# EAGLE design Raspi-TPUART (EAGLE 9.6.2)
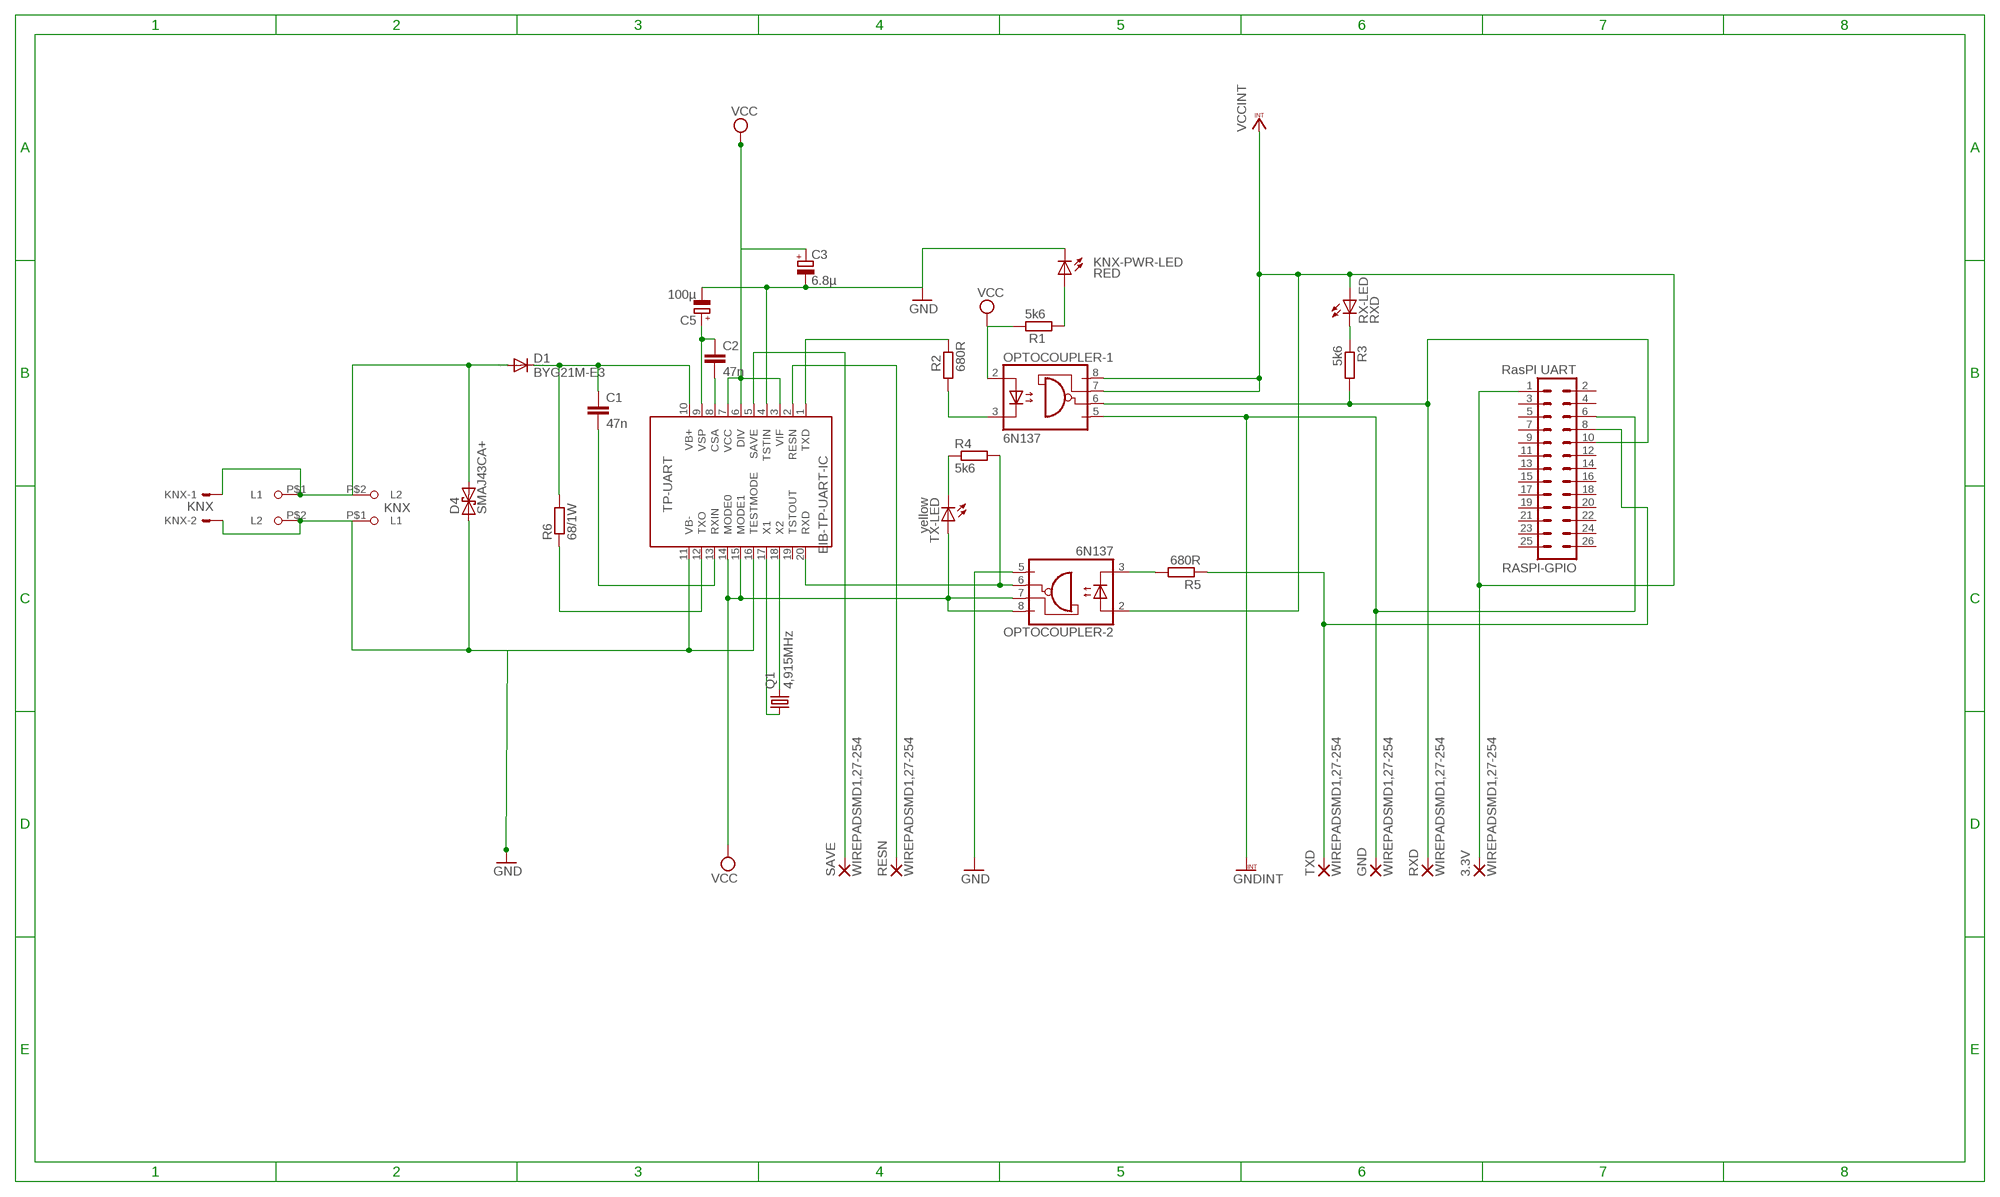
[diagram p0: schematic, sheet 1]

## Parts
3.3V  WIREPADSMD1,27-254  [SMD1,27-2,54]
C1  47n  C-EUC1206  [C1206]
C2  47n  C-EUC1206  [C1206]
C3  6.8µ  CPOL-EUD/7343-31R  [D/7343-31R]
C5  100µ  CPOL-EUD/7343-31R  [D/7343-31R]
D1  BYG21M-E3  ES2D  [SMB]
D4  SMAJ43CA+  BZW04XXB  [DO214AA]
EIB-TP-UART-IC  TP-UART  [SOIC20]
GND  WIREPADSMD1,27-254  [SMD1,27-2,54]
KNX  KNX  22-23-2021  [22-23-2021]
KNX-PWR-LED  RED  LEDKA-3528ASYC  [KA-3528ASYC]
KNX_WAGO_243  243-211  [243-211]
OPTOCOUPLER-1  6N137  [DIL8-SMD]
OPTOCOUPLER-2  6N137  [DIL8-SMD]
Q1  4,915MHz  CRYSTALHC49UP  [HC49UP]
R1  5k6  R-EU_M1206  [M1206]
R2  680R  R-EU_M1206  [M1206]
R3  5k6  R-EU_M1206  [M1206]
R4  5k6  R-EU_M1206  [M1206]
R5  680R  R-EU_M1206  [M1206]
R6  68/1W  R-EU_R2512  [R2512]
RASPI-GPIO  RasPI UART  MA13-2  [MA13-2]
RESN  WIREPADSMD1,27-254  [SMD1,27-2,54]
RX-LED  RXD  LEDKA-3528ASYC  [KA-3528ASYC]
RXD  WIREPADSMD1,27-254  [SMD1,27-2,54]
SAVE  WIREPADSMD1,27-254  [SMD1,27-2,54]
TX-LED  yellow  LEDKA-3528ASYC  [KA-3528ASYC]
TXD  WIREPADSMD1,27-254  [SMD1,27-2,54]
U$1  243-211  [243-211]

## Nets
CSA: C2.2 EIB-TP-UART-IC.8(CSA)
GND [supply]: C3.- C5.- D4.A EIB-TP-UART-IC.4(TSTIN) EIB-TP-UART-IC.11(VB-) EIB-TP-UART-IC.16(TESTMODE) KNX-PWR-LED.C KNX.2 KNX_WAGO_243.P$1(L1) OPTOCOUPLER-2.5(GND) U$1.P$2(L2)
GNDINT [supply]: GND.1(P) OPTOCOUPLER-1.5(GND) RASPI-GPIO.6
KNX+ [supply]: D1.A D4.C KNX.1 KNX_WAGO_243.P$2(L2) U$1.P$1(L1)
N$1: R3.1 RX-LED.C
N$3: R4.1 TX-LED.C
N$14: OPTOCOUPLER-2.3(C) R5.2
N$18: KNX-PWR-LED.A R1.1
RASPI_RXD: OPTOCOUPLER-1.6(VO) R3.2 RASPI-GPIO.10 RXD.1(P)
RASPI_TXD: R5.1 RASPI-GPIO.8 TXD.1(P)
RESN: EIB-TP-UART-IC.2(RESN) RESN.1(P)
RXD: EIB-TP-UART-IC.20(RXD) OPTOCOUPLER-2.6(VO) R4.2
RXIN: C1.2 EIB-TP-UART-IC.13(RXIN)
SAVE: EIB-TP-UART-IC.5(SAVE) SAVE.1(P)
TXD: EIB-TP-UART-IC.1(TXD) R2.2
TXD1: OPTOCOUPLER-1.3(C) R2.1
TXO: EIB-TP-UART-IC.12(TXO) R6.1
VB+ [supply]: C1.1 D1.C EIB-TP-UART-IC.10(VB+) R6.2
VCC [supply]: C3.+ EIB-TP-UART-IC.3(VIF) EIB-TP-UART-IC.6(DIV) EIB-TP-UART-IC.7(VCC) EIB-TP-UART-IC.14(MODE0) EIB-TP-UART-IC.15(MODE1) OPTOCOUPLER-1.2(A) OPTOCOUPLER-2.7(VE) OPTOCOUPLER-2.8(VCC) R1.2 TX-LED.A
VCCINT [supply]: 3.3V.1(P) OPTOCOUPLER-1.7(VE) OPTOCOUPLER-1.8(VCC) OPTOCOUPLER-2.2(A) RASPI-GPIO.1 RX-LED.A
VSP: C2.1 C5.+ EIB-TP-UART-IC.9(VSP)
X1: EIB-TP-UART-IC.17(X1) Q1.1
X2: EIB-TP-UART-IC.18(X2) Q1.2
Unconnected: EIB-TP-UART-IC.19(TSTOUT) RASPI-GPIO.2 RASPI-GPIO.3 RASPI-GPIO.4 RASPI-GPIO.5 RASPI-GPIO.7 RASPI-GPIO.9 RASPI-GPIO.11 RASPI-GPIO.12 RASPI-GPIO.13 RASPI-GPIO.14 RASPI-GPIO.15 RASPI-GPIO.16 RASPI-GPIO.17 RASPI-GPIO.18 RASPI-GPIO.19 RASPI-GPIO.20 RASPI-GPIO.21 RASPI-GPIO.22 RASPI-GPIO.23 RASPI-GPIO.24 RASPI-GPIO.25 RASPI-GPIO.26

## Library data of the parts
3.3V GND RESN RXD SAVE TXD = wirepad:WIREPAD: Wire PAD connect wire on PCB
C1 C2 = resistor:C-EU: CAPACITOR, European symbol
C3 C5 = resistor:CPOL-EU: POLARIZED CAPACITOR, European symbol
D1 = diode:ES2D: DIODE super fast rectifier, 2 A
D4 = diode:BZW04XXB: DIODE uni and bidirectional supressor diode
EIB-TP-UART-IC = tpuart-actiface:TP-UART: Siemens TP-UART
KNX = con-molex:22-23-2021: .100" (2.54mm) Center Header - 2 Pin; MF: MOLEX; MPN: 22-23-2021; OC_FARNELL: 1462926; OC_NEWARK: 25C3832
KNX-PWR-LED RX-LED TX-LED = led:LED: LED OSRAM: - CHIPLED LG R971, LG N971, LY N971, LG Q971, LY Q971, LO R971, LY R971 LH N974, LH R974 LS Q976, LO Q976, LY Q976 LO Q996 - Hyper CHIPLED LW Q18S LB Q993, LB Q99A, LB R99A - SideLED LS A670, LO A670, LY A670, LG A670, LP A670 LB A673, LV A673, LT A673, LW A673 LH A674 LY A675 LS A676, LA A676, LO A676, LY A676, LW A676 LS A679, LY A679, LG A679 - Hyper Micro SIDELED® LS Y876, LA Y876, LO Y876, LY Y876 LT Y87S - SmartLED LW L88C, LW L88S LB L89C, LB L89S, LG L890 LS L89K, LO L89K, LY L89K LS L896, LA L896, LO L896, LY L896 - TOPLED LS T670, LO T670, LY T670, LG T670, LP T670 LSG T670, LSP T670, LSY T670, LOP T670, LYG T670 LG T671, LOG T671, LSG T671 LB T673, LV T673, LT T673, LW T673 LH T674 LS T676, LA T676, LO T676, LY T676, LB T676, LH T676, LSB T676, LW T676 LB T67C, LV T67C, LT T67C, LS T67K, LO T67K, LY T67K, LW E67C LS E67B, LA E67B, LO E67B, LY E67B, LB E67C, LV E67C, LT E67C LW T67C LS T679, LY T679, LG T679 LS T770, LO T770, LY T770, LG T770, LP T770 LB T773, LV T773, LT T773, LW T773 LH T774 LS E675, LA E675, LY E675, LS T675 LS T776, LA T776, LO T776, LY T776, LB T776 LHGB T686 LT T68C, LB T68C - Hyper Mini TOPLED® LB M676 - Mini TOPLED Santana® LG M470 LS M47K, LO M47K, LY M47K Source: http://www.osram.convergy.de LUXEON: - LUMILED® LXK2-PW12-R00, LXK2-PW12-S00, LXK2-PW14-U00, LXK2-PW14-V00 LXK2-PM12-R00, LXK2-PM12-S00, LXK2-PM14-U00 LXK2-PE12-Q00, LXK2-PE12-R00, LXK2-PE12-S00, LXK2-PE14-T00, LXK2-PE14-U00 LXK2-PB12-K00, LXK2-PB12-L00, LXK2-PB12-M00, LXK2-PB14-N00, LXK2-PB14-P00, LXK2-PB14-Q00 LXK2-PR12-L00, LXK2-PR12-M00, LXK2-PR14-Q00, LXK2-PR14-R00 LXK2-PD12-Q00, LXK2-PD12-R00, LXK2-PD12-S00 LXK2-PH12-R00, LXK2-PH12-S00 LXK2-PL12-P00, LXK2-PL12-Q00, LXK2-PL12-R00 Source: www.luxeon.com KINGBRIGHT: KA-3528ASYC Source: www.kingbright.com
KNX_WAGO_243 U$1 = wago-243:243-211: WAGO 243-211 KNX-Connector
OPTOCOUPLER-1 OPTOCOUPLER-2 = optocoupler:6N137: MOTOROLA OPTO COUPLER
Q1 = crystal:CRYSTAL: CRYSTAL; OC_FARNELL: unknown; OC_NEWARK: unknown
R1-R6 = resistor:R-EU_: RESISTOR, European symbol
RASPI-GPIO = con-lstb:MA13-2: PIN HEADER; OC_FARNELL: unknown; OC_NEWARK: unknown

## Net classes
0 default: width 0.3 mm
1 supply: width 0.6 mm

## Board
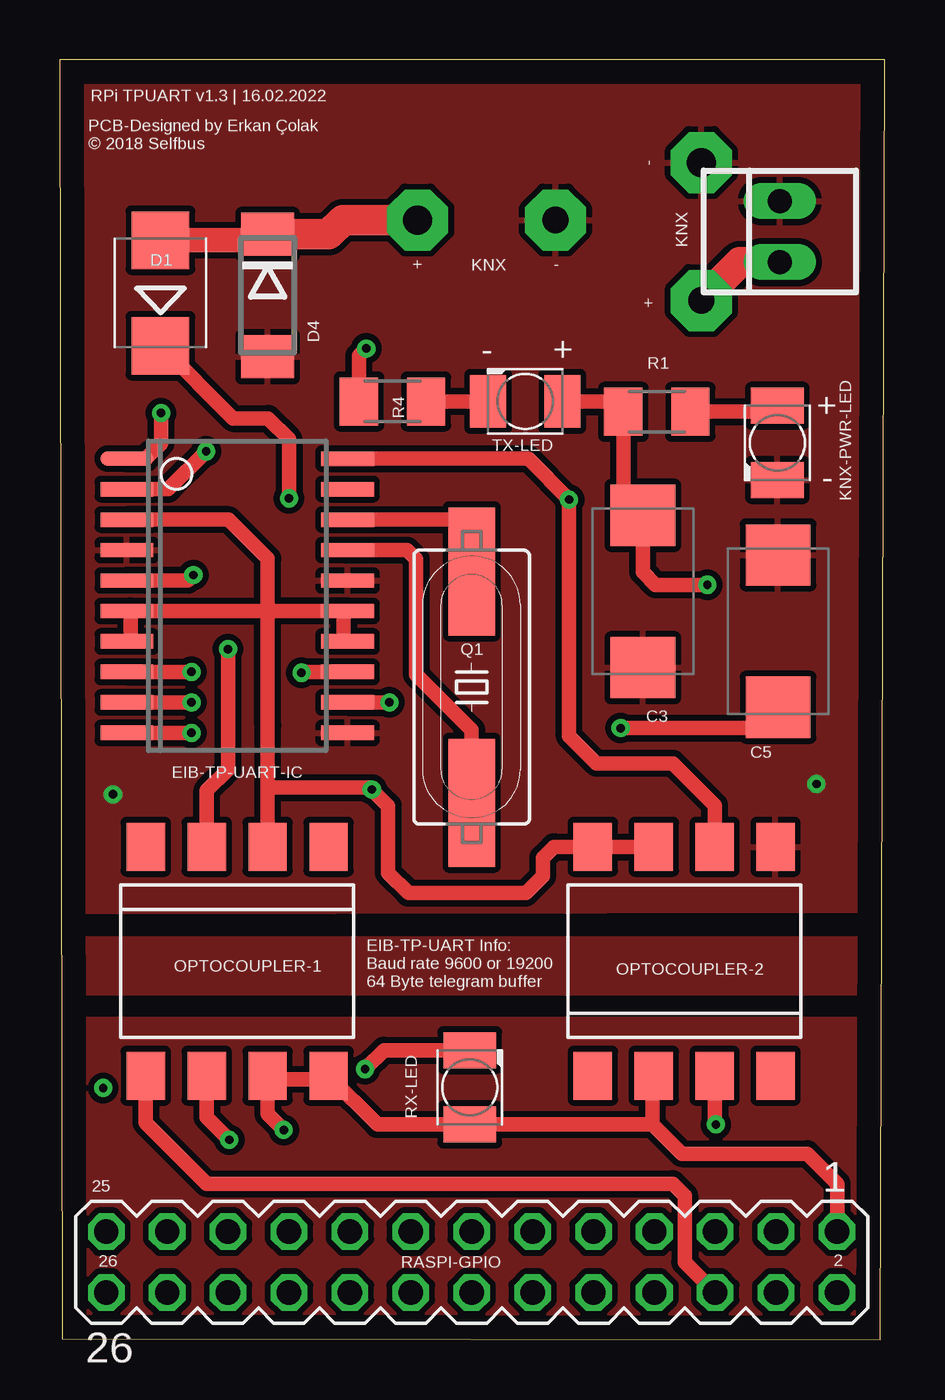
[diagram p1: board, top side]
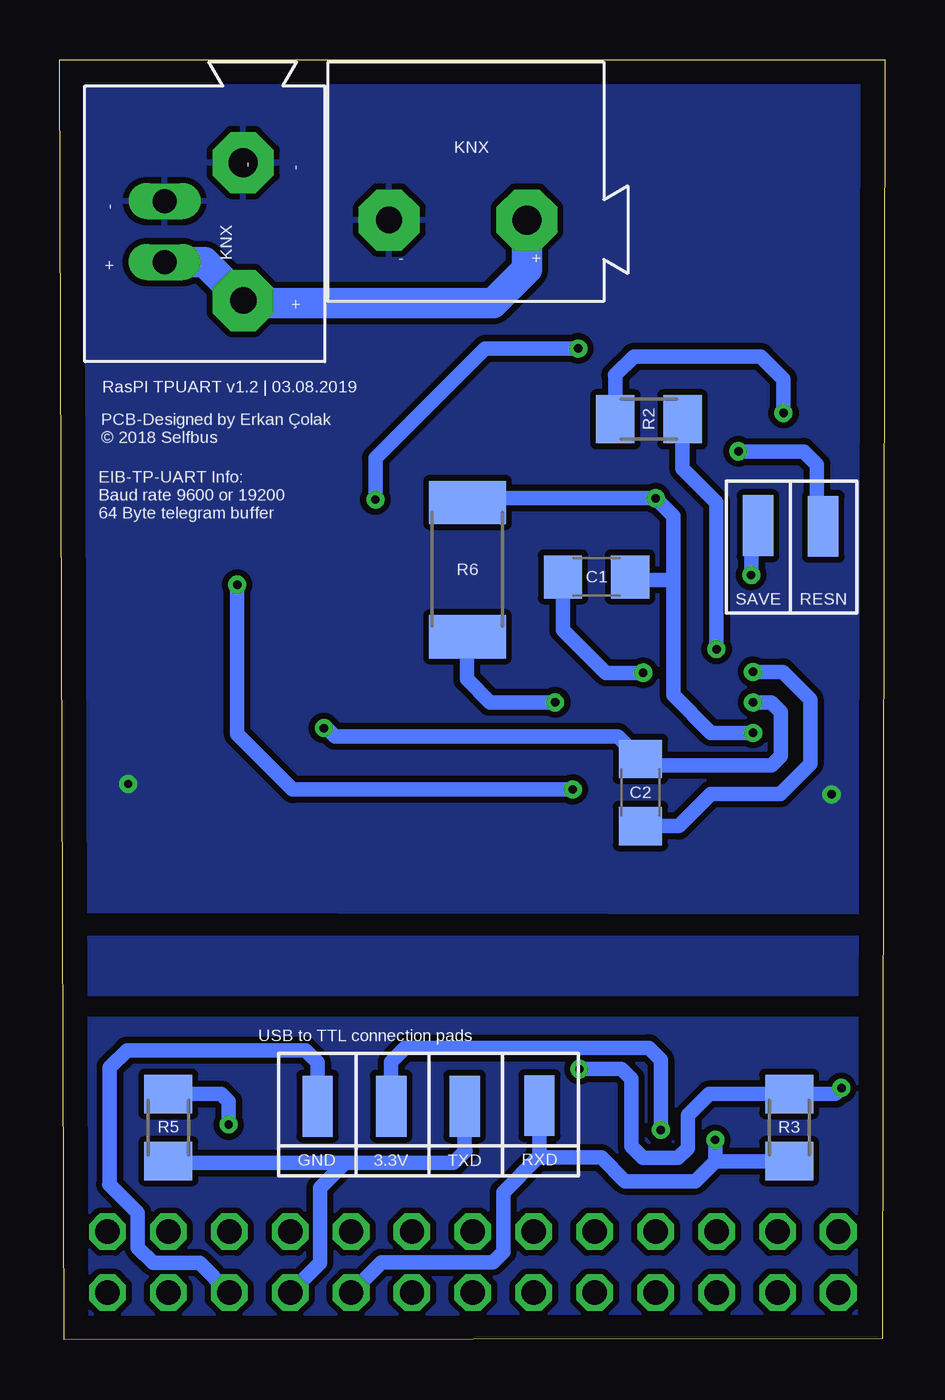
[diagram p2: board, bottom side, seen from below]

Size 34.39 x 53.36 mm. Coordinates in mm from the lower left corner, seen from the top.
Outline: 0.1,0.03 34.21,0 34.39,53.36 0,53.36 0.1,0.03
Copper layers (1*16): Top 0.035mm / dielectric 1.5mm / Bottom 0.035mm
Design rules "default": minimum track width 6mil, minimum drill 0.35mm, track to track 6mil, track to pad 6mil, pad to pad 6mil, via to via 6mil, smd to smd 6mil, copper to edge 40mil, drill to drill 6mil, minimum pad ring 10mil, minimum via ring 8mil, stop-mask expansion 4mil, vias tented up to drill 0mil, thermal gap 10mil

### Footprints (pad centres in the part's own frame; a part is rotated, then mirrored left to right if it is on the bottom)
SMD1,27-2,54 = smd 1.27 x 2.54: 1 0,0
C1206 = smd 1.6 x 1.8: 1 -1.4,0; 2 1.4,0
D/7343-31R = smd 2.55 x 2.7: + 3.175,0; - -3.175,0
SMB = smd 2.4 x 2.4: A 2.2,0; C -2.2,0
DO214AA = smd 1.8 x 2.2: A 2.55,0; C -2.55,0
SOIC20 = smd 0.6 x 2.2: 1 -5.715,-4.6; 2 -4.445,-4.6; 3 -3.175,-4.6; 4 -1.905,-4.6; 5 -0.635,-4.6; 6 0.635,-4.6; 7 1.905,-4.6; 8 3.175,-4.6; 9 4.445,-4.6; 10 5.715,-4.6; 11 5.715,4.6; 12 4.445,4.6; 13 3.175,4.6; 14 1.905,4.6; 15 0.635,4.6; 16 -0.635,4.6; 17 -1.905,4.6; 18 -3.175,4.6; 19 -4.445,4.6; 20 -5.715,4.6
22-23-2021 = drill 1 long: 1 -1.27,0; 2 1.27,0
KA-3528ASYC = smd 1.5 x 2.2: A -1.55,0; C 1.55,0
243-211 = drill 1.1 pad 2.54 octagon: P$1 8.95,6.6 | drill 1.2 pad 2.54 octagon: P$2 3.2,6.6
DIL8-SMD = smd 1.6 x 2: 1 -3.81,-4.77; 2 -1.27,-4.77; 3 1.27,-4.77; 4 3.81,-4.77; 5 3.81,4.77; 6 1.27,4.77; 7 -1.27,4.77; 8 -3.81,4.77
HC49UP = smd 5.334 x 1.93: 1 -4.826,0; 2 4.826,0
M1206 = smd 1.6 x 2: 1 -1.4,0; 2 1.4,0
R2512 = smd 1.8 x 3.2: 1 -2.8,0; 2 2.8,0
MA13-2 = drill 1.016 octagon: 1 -15.24,-1.27; 2 -15.24,1.27; 3 -12.7,-1.27; 4 -12.7,1.27; 5 -10.16,-1.27; 6 -10.16,1.27; 7 -7.62,-1.27; 8 -7.62,1.27; 9 -5.08,-1.27; 10 -5.08,1.27; 11 -2.54,-1.27; 12 -2.54,1.27; 13 0,-1.27; 14 0,1.27; 15 2.54,-1.27; 16 2.54,1.27; 17 5.08,-1.27; 18 5.08,1.27; 19 7.62,-1.27; 20 7.62,1.27; 21 10.16,-1.27; 22 10.16,1.27; 23 12.7,-1.27; 24 12.7,1.27; 25 15.24,-1.27; 26 15.24,1.27

### Placement (x,y rotation side)
3.3V  20.58,9.73 180 bottom
C1  12.01,31.8 180 bottom
C2  10.19,22.81 270 bottom
C3  24.31,31.19 90 top
C5  29.95,29.54 270 top
D1  4.19,43.64 90 top
D4  8.66,43.54 270 top
EIB-TP-UART-IC  7.39,31.01 270 top
GND  23.65,9.73 180 bottom
KNX  30.02,46.2 90 top
KNX-PWR-LED  29.92,37.39 270 top
KNX_WAGO_243  11.71,53.28 180 bottom
OPTOCOUPLER-1  7.39,15.77 180 top
OPTOCOUPLER-2  26.04,15.77 0 top
Q1  17.17,27.2 90 top
R1  24.89,38.68 180 top
R2  9.83,38.38 180 bottom
R3  3.98,8.84 270 bottom
R4  13.87,39.12 180 top
R5  29.87,8.84 90 bottom
R6  17.4,32.11 90 bottom
RASPI-GPIO  17.17,3.23 180 top
RESN  2.57,33.91 180 bottom
RX-LED  17.09,10.52 90 top
RXD  14.39,9.75 180 bottom
SAVE  5.28,33.93 180 bottom
TX-LED  19.41,39.12 180 top
TXD  17.51,9.73 180 bottom
U$1  33.35,52.27 270 bottom

### Tracks (layer width: path | path; a pad name or v marks a point on that pad's centre or on a via)
CSA  (via drill 0.35)
  Top 0.61: EIB-TP-UART-IC.8 v5.49,27.84
  Bottom 0.61: v5.49,27.84 4.24,27.84 3.1,26.7 3.1,24 4.34,22.76 7.24,22.76 8.59,21.41 C2.2
GND  (via drill 0.35)
  other vias: 31.55,23.16 2.21,22.73
  pour Top (isolate 0.254): 0.18,53.19 34.21,53.19 34.09,17.86 0.23,17.78
  pour Bottom (isolate 0.254): 0.18,53.19 0.23,17.78 34.09,17.86 34.21,53.19
GNDINT
  Top 0.6: OPTOCOUPLER-1.5
  Top 0.61: OPTOCOUPLER-1.5 3.58,9.04 6.12,6.5 25.55,6.5 26.06,5.99 26.06,3.23 RASPI-GPIO.6
  Bottom 0.61: RASPI-GPIO.6 28.58,3.2 30.51,3.2 31.14,3.84 31.14,5.28 32.33,6.48 32.31,6.5 32.31,11.35 31.6,12.07 24.16,12.07 23.65,11.56 GND.1 23.65,9.86
KNX+
  Top 0.61: 8.41,45.84 D4.C
  Top 1.016: D1.A 8.41,45.84
  Top 1.27: D4.C 11.21,46.09 11.81,46.68 KNX_WAGO_243.P$2 | KNX.1 28.36,44.93 U$1.P$1
  Bottom 1.27: KNX_WAGO_243.P$2 14.92,44.62 16.33,43.21 26.63,43.21 U$1.P$1 28.36,44.93 KNX.1
N$1  (via drill 0.35)
  Top 0.61: v12.73,11.28 13.51,12.07 RX-LED.C
  Bottom 0.61: v1.8,10.49 2.05,10.24 R3.1 7.31,10.24 8.2,9.35 8.2,7.98 8.61,7.57 10.08,7.57 10.57,8.05 10.57,10.87 10.97,11.28 v12.73,11.28
N$2
  pour Top (isolate 0.254): 0.38,13.39 0.38,0.33 33.99,0.28 34.06,13.39
N$3
  Top 0.61: TX-LED.C R4.1
N$11
  pour Bottom (isolate 0.254): 0.38,13.39 34.06,13.39 33.99,0.28 0.38,0.33
N$13
  pour Top: 0.38,16.76 33.96,16.76 33.96,14.38 0.38,14.4
N$14  (via drill 0.35)
  Top 0.61: 27.36,10.95 OPTOCOUPLER-2.3 27.31,9.02 v27.36,8.97
  Bottom 0.61: R5.2 27.66,10.24 27.36,9.93 v27.36,8.97
N$15
  pour Bottom: 0.38,16.76 33.96,16.76 33.96,14.38 0.38,14.4
N$18
  Top 0.61: KNX-PWR-LED.A 29.95,38.74 29.9,38.68 R1.1
RASPI_RXD  (via drill 0.35)
  Top 0.3: 6.12,10.69 OPTOCOUPLER-1.6
  Top 0.508: OPTOCOUPLER-1.6 6.12,10.95
  Top 0.61: OPTOCOUPLER-1.6 6.12,9.27 v7.06,8.33
  Bottom 0.61: RXD.1 14.39,7.67 14.45,7.61 14.45,7.59 | RASPI-GPIO.10 20.98,3.23 16.33,3.23 15.9,3.66 15.9,6.15 14.45,7.59 | R3.2 7.06,7.44 | 7.06,7.44 v7.06,8.33 | 14.45,7.59 11.81,7.59 10.82,6.6 7.9,6.6 7.06,7.44
RASPI_TXD
  Bottom 0.61: RASPI-GPIO.8 23.55,3.2 23.55,6.32 22.5,7.37 | R5.1 29.8,7.37 22.5,7.37 | 22.5,7.37 17.98,7.37 17.48,7.87 17.51,7.91 TXD.1
RESN  (via drill 0.35)
  Top 0.61: EIB-TP-UART-IC.2 4.52,35.46 v6.1,37.03
  Bottom 0.61: v6.1,37.03 3.38,37.03 2.82,36.47 2.82,34.8 RESN.1
RXD  (via drill 0.35)
  Top 0.61: OPTOCOUPLER-2.6 27.31,22.28 25.55,24.03 22.38,24.03 21.23,25.17 v21.23,35.03 19.53,36.73 EIB-TP-UART-IC.20 | R4.2 12.47,41.02 v12.78,41.33
  Bottom 0.61: v21.23,35.03 21.23,36.75 16.66,41.33 v12.78,41.33
RXIN  (via drill 0.35)
  Top 0.3: EIB-TP-UART-IC.13 11.2,27.84
  Top 0.61: 11.2,27.84 10.11,27.84 v10.07,27.8
  Bottom 0.61: v10.07,27.8 11.62,27.8 13.41,29.59 C1.2
SAVE  (via drill 0.35)
  Top 0.61: v5.56,31.88 5.33,31.65 EIB-TP-UART-IC.5
  Bottom 0.61: SAVE.1 5.56,32.72 v5.56,31.88
TXD  (via drill 0.35)
  Top 0.3: 2.95,36.73 EIB-TP-UART-IC.1
  Top 0.61: EIB-TP-UART-IC.1 3.58,36.73 4.22,37.36 v4.22,38.63
  Bottom 0.61: v4.22,38.63 4.22,40.06 5.16,41 10.47,41 11.25,40.21 11.23,40.19 R2.2
TXD1  (via drill 0.35)
  Top 0.61: OPTOCOUPLER-1.3 6.12,22.89 7.01,23.77 v7.01,28.79
  Bottom 0.61: R2.1 8.43,36.32 7.01,34.9 v7.01,28.79
TXO  (via drill 0.35)
  Top 0.61: EIB-TP-UART-IC.12 v13.74,26.57
  Bottom 0.61: 16.45,29.03 R6.1 17.42,29.28 17.42,27.53 16.46,26.57 v13.74,26.57
VB+  (via drill 0.35)
  Top 0.6: EIB-TP-UART-IC.10 v5.49,25.3
  Top 0.61: 4.19,41.3 D1.C 7.22,38.4 8.69,38.4 9.55,37.54 v9.55,35.08
  Bottom 0.61: v5.49,25.3 7.24,25.3 8.81,26.87 8.81,31.67 | 8.81,31.67 8.81,34.34 v9.55,35.08 17.23,35.08 R6.2 | 8.81,31.67 10.49,31.67 C1.1
VCC  (via drill 0.35)
  Top 0.6: EIB-TP-UART-IC.7 2.95,29.11 2.95,30.38 EIB-TP-UART-IC.6 | 8.66,25.62 8.66,23.01 OPTOCOUPLER-1.2 | 11.84,30.38 EIB-TP-UART-IC.15 | 11.84,29.11 EIB-TP-UART-IC.14
  Top 0.61: 11.84,29.11 11.84,30.22 EIB-TP-UART-IC.15 8.79,30.38 | 22.18,20.5 OPTOCOUPLER-2.8 | 24.71,20.59 OPTOCOUPLER-2.7 OPTOCOUPLER-2.8 | 8.66,25.62 8.66,30.25 | 8.79,30.38 8.66,30.25 | 2.95,30.38 8.79,30.38 | 8.66,30.25 8.66,32.56 7.04,34.19 EIB-TP-UART-IC.3 | v27,31.47 24.84,31.47 24.31,32 C3.+ | C3.+ 24.28,34.42 | 8.66,23.01 12.93,23.01 v13.01,22.94 13.69,22.25 13.69,19.46 14.53,18.62 19.43,18.62 20.14,19.33 20.14,20.09 20.6,20.55 20.6,20.54 OPTOCOUPLER-2.8 | C3.+ 23.49,35.21 R1.2 23.06,39.12 TX-LED.A
  Bottom 0.61: v13.01,22.94 24.69,22.94 27,25.25 v27,31.47
VCCINT  (via drill 0.35)
  Top 0.6: 11.2,10.69 OPTOCOUPLER-1.8 | 11.06,10.48 OPTOCOUPLER-1.8 | 8.69,10.93 OPTOCOUPLER-1.7 | OPTOCOUPLER-1.7 8.98,10.85 10.88,10.85 OPTOCOUPLER-1.8 | 8.98,10.53 OPTOCOUPLER-1.7
  Top 0.61: RASPI-GPIO.1 32.41,6.5 31.17,7.75 25.93,7.75 24.71,8.97 | 24.71,8.97 24.71,10.95 OPTOCOUPLER-2.2 | OPTOCOUPLER-1.7 8.66,9.41 v9.33,8.74 | RX-LED.A | RX-LED.A 13.24,8.97 OPTOCOUPLER-1.8 | RX-LED.A 24.71,8.97
  Bottom 0.61: 3.3V.1 20.58,11.58 19.99,12.17 9.83,12.17 9.33,11.67 v9.33,8.74
VSP  (via drill 0.35)
  Top 0.61: v5.49,26.57 EIB-TP-UART-IC.9 | v23.38,25.5 28.98,25.5 C5.+
  Bottom 0.61: v23.38,25.5 23.33,25.55 22.92,25.15 11.12,25.15 C2.1 9.9,23.93 4.72,23.93 4.32,24.33 4.32,26.16 4.72,26.57 v5.49,26.57
X1
  Top 0.61: EIB-TP-UART-IC.17 14.48,32.92 14.86,32.54 14.86,27.74 17.17,25.43 Q1.1
X2
  Top 0.61: EIB-TP-UART-IC.18 17.17,34.19 Q1.2

### Text on the board
tNames: RPi TPUART v1.3 | 16.02.2022 | PCB-Designed by Erkan Çolak / © 2018 Selfbus | - | + | KNX | - | + | - | + | + | - | EIB-TP-UART Info: / Baud rate 9600 or 19200 / 64 Byte telegram buffer | 25 | 26 | 2
bNames: KNX | - | - | - | + | - | KNX | + | + | RasPI TPUART v1.2 | 03.08.2019 | PCB-Designed by Erkan Çolak / © 2018 Selfbus | EIB-TP-UART Info: / Baud rate 9600 or 19200 / 64 Byte telegram buffer | USB to TTL connection pads
tDocu: - | +